# Altium schematic sheet Main_Sheet.SchDoc
size A2; SheetNumber: 1; SheetTotal: 5
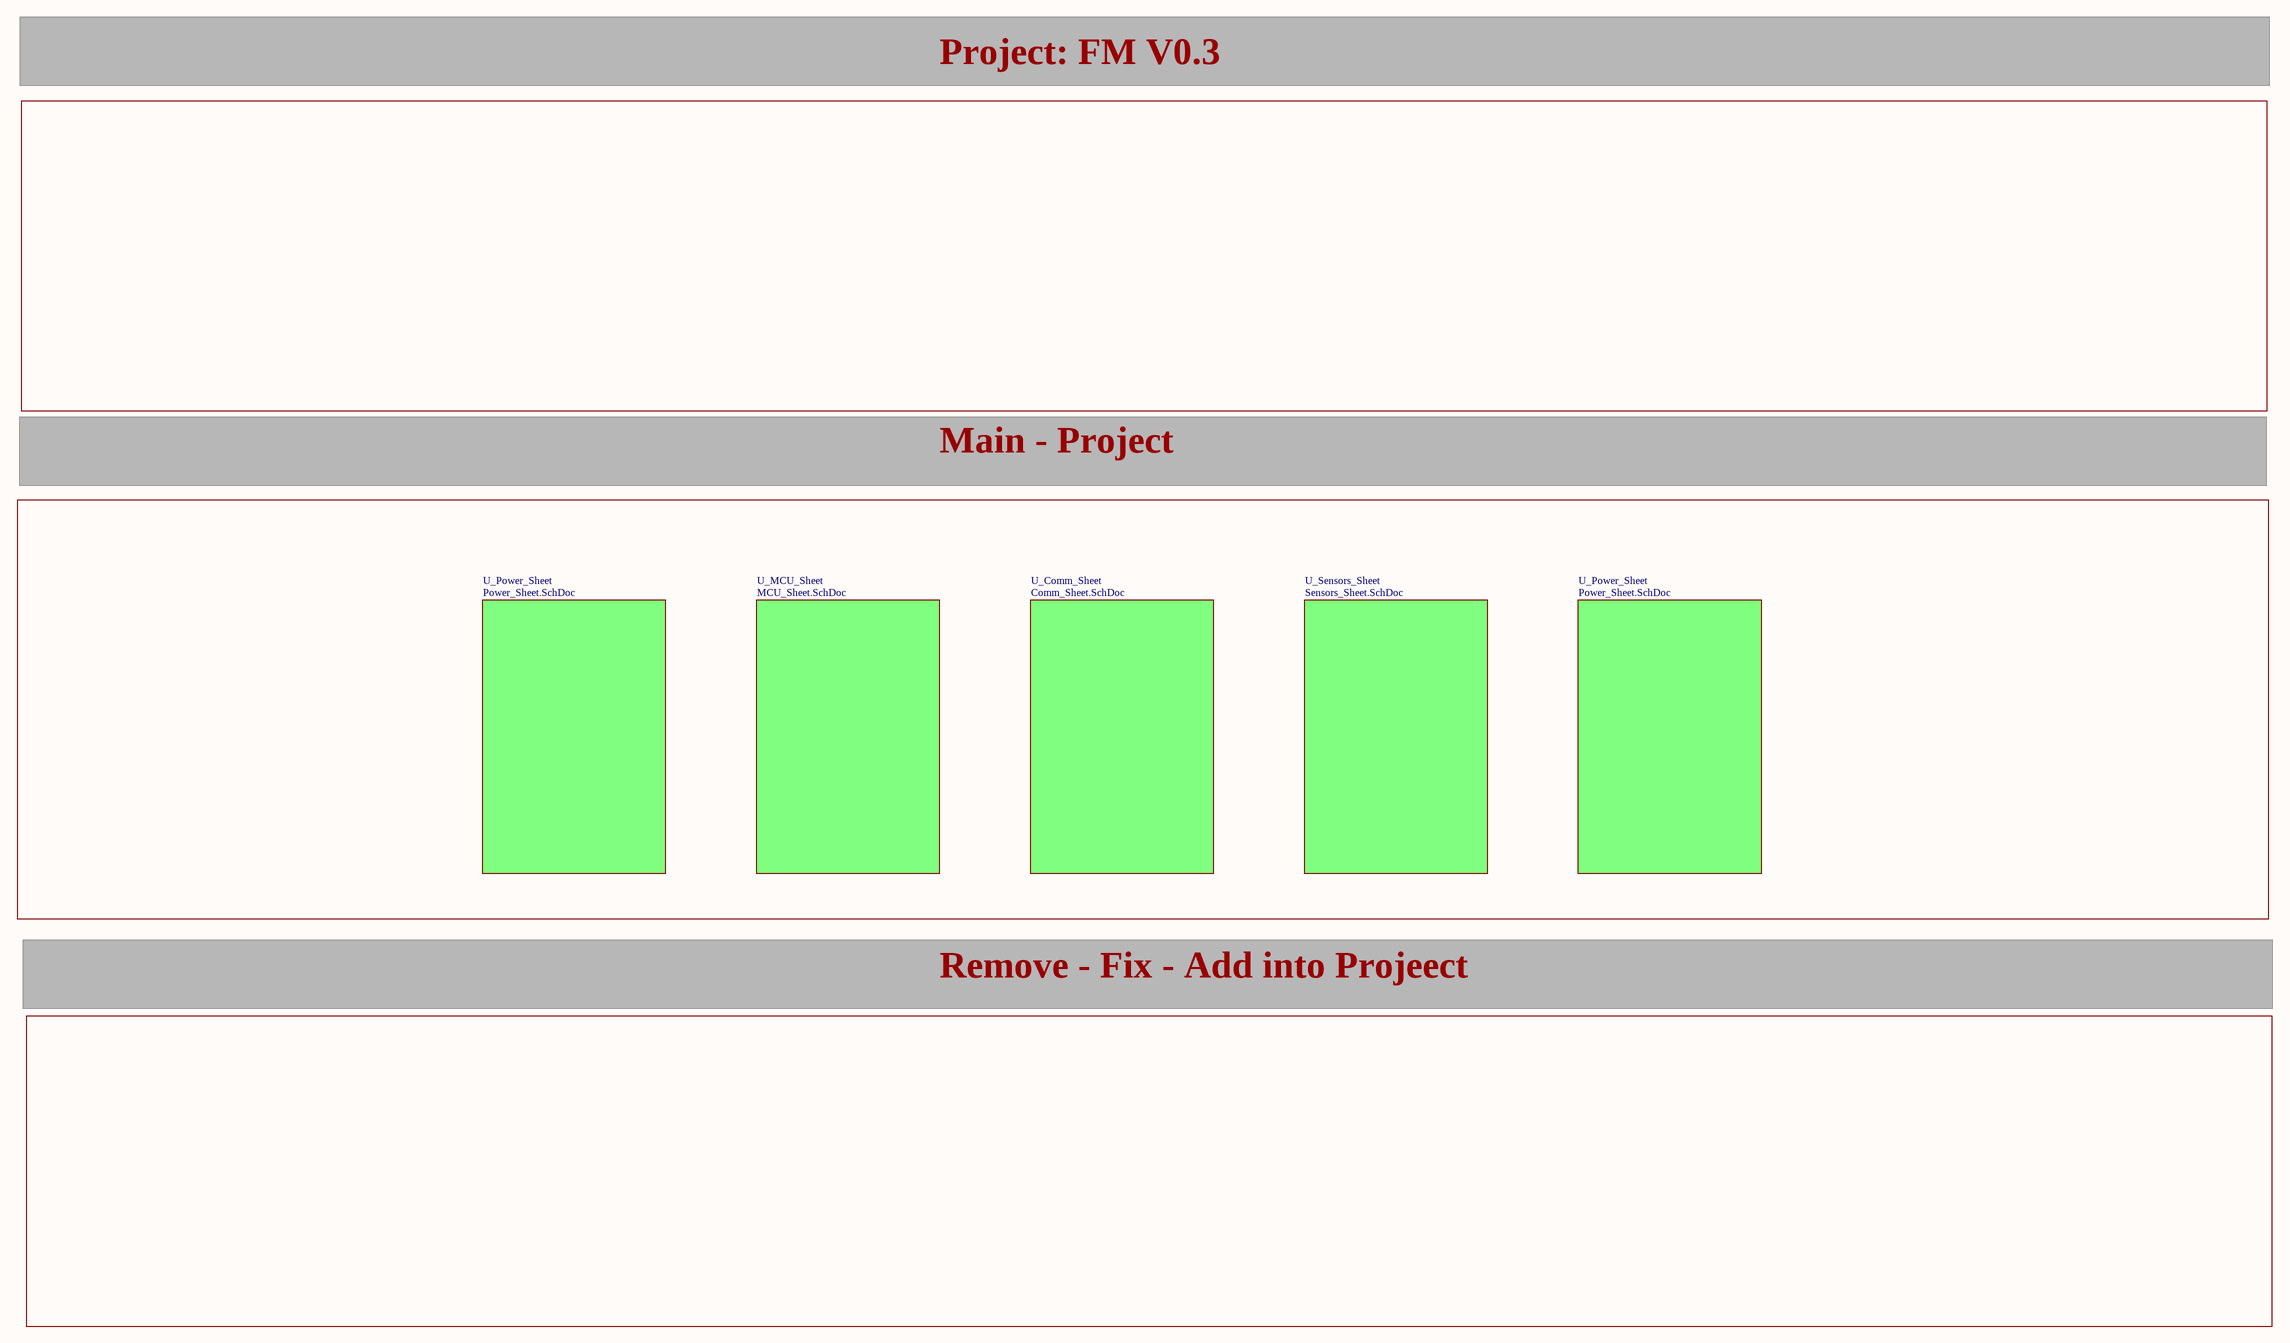
[diagram p0: Main_Sheet.SchDoc]

## Sub-sheets
U_Comm_Sheet = Comm_Sheet.SchDoc: no entries
U_MCU_Sheet = MCU_Sheet.SchDoc: no entries
U_Power_Sheet = Power_Sheet.SchDoc: no entries
U_Power_Sheet = Power_Sheet.SchDoc: no entries
U_Sensors_Sheet = Sensors_Sheet.SchDoc: no entries

## Notes on the sheet
- Project: FM V0.3
- Main - Project
- Remove - Fix - Add into Projeect